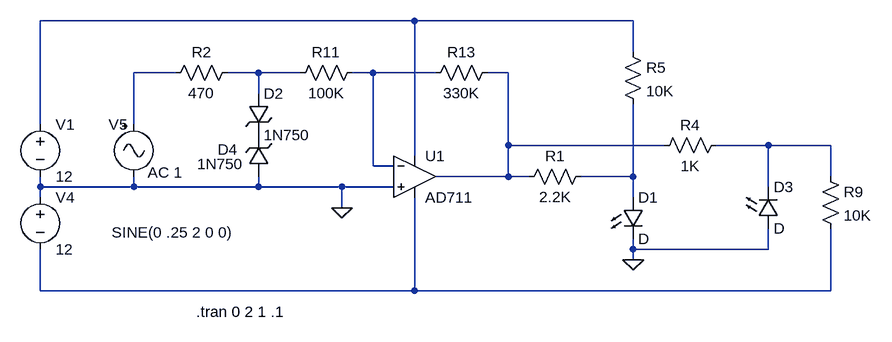
[diagram p0: schematic sigmon2.asc]
sigmon2.asc, the LTspice schematic file:
Version 4
SHEET 1 1412 736
WIRE 336 128 -240 128
WIRE 672 128 336 128
WIRE 672 176 672 128
WIRE -32 208 -96 208
WIRE 96 208 48 208
WIRE 160 208 96 208
WIRE 272 208 240 208
WIRE 368 208 272 208
WIRE 480 208 448 208
WIRE 96 240 96 208
WIRE -240 288 -240 128
WIRE -96 288 -96 208
WIRE 480 320 480 208
WIRE 720 320 480 320
WIRE 880 320 800 320
WIRE 976 320 880 320
WIRE 336 336 336 128
WIRE 272 352 272 208
WIRE 304 352 272 352
WIRE 480 368 480 320
WIRE 480 368 368 368
WIRE 512 368 480 368
WIRE 672 368 672 256
WIRE 672 368 592 368
WIRE 976 368 976 320
WIRE -240 384 -240 368
WIRE -96 384 -96 368
WIRE -96 384 -240 384
WIRE 96 384 96 368
WIRE 96 384 -96 384
WIRE 224 384 96 384
WIRE 304 384 224 384
WIRE 880 384 880 320
WIRE -240 400 -240 384
WIRE 672 400 672 368
WIRE 224 416 224 384
WIRE 672 480 672 464
WIRE 880 480 880 448
WIRE 880 480 672 480
WIRE 672 496 672 480
WIRE -240 544 -240 480
WIRE 336 544 336 400
WIRE 336 544 -240 544
WIRE 976 544 976 448
WIRE 976 544 336 544
FLAG 224 416 0
FLAG 672 496 0
SYMBOL voltage -240 272 R0
WINDOW 123 0 0 Left 0
WINDOW 39 0 0 Left 0
SYMATTR InstName V1
SYMATTR Value 12
SYMBOL voltage -240 384 R0
WINDOW 123 0 0 Left 0
WINDOW 39 0 0 Left 0
SYMATTR InstName V4
SYMATTR Value 12
SYMBOL res 256 192 R90
WINDOW 0 0 56 VBottom 2
WINDOW 3 32 56 VTop 2
SYMATTR InstName R11
SYMATTR Value 100K
SYMBOL res 464 192 R90
WINDOW 0 0 56 VBottom 2
WINDOW 3 32 56 VTop 2
SYMATTR InstName R13
SYMATTR Value 330K
SYMBOL Misc\\signal -96 272 R0
WINDOW 123 21 90 Left 2
WINDOW 39 0 0 Left 0
WINDOW 3 -34 182 Left 2
WINDOW 0 -39 16 Left 2
SYMATTR Value2 AC 1
SYMATTR Value SINE(0 .25 2 0 0)
SYMATTR InstName V5
SYMBOL Opamps\\AD711 336 304 R0
SYMATTR InstName U1
SYMBOL LED 656 400 R0
SYMATTR InstName D1
SYMBOL res 496 384 R270
WINDOW 0 32 56 VTop 2
WINDOW 3 0 56 VBottom 2
SYMATTR InstName R1
SYMATTR Value 2.2K
SYMBOL res 656 160 R0
SYMATTR InstName R5
SYMATTR Value 10K
SYMBOL LED 864 448 M180
WINDOW 0 24 64 Left 2
WINDOW 3 24 0 Left 2
SYMATTR InstName D3
SYMBOL res 704 336 R270
WINDOW 0 32 56 VTop 2
WINDOW 3 0 56 VBottom 2
SYMATTR InstName R4
SYMATTR Value 1K
SYMBOL res 960 352 R0
SYMATTR InstName R9
SYMATTR Value 10K
SYMBOL zener 112 368 R180
WINDOW 0 48 42 Left 2
WINDOW 3 39 19 Left 2
SYMATTR InstName D4
SYMATTR Value 1N750
SYMATTR Description Diode
SYMATTR Type diode
SYMBOL res 64 192 R90
WINDOW 0 0 56 VBottom 2
WINDOW 3 32 56 VTop 2
SYMATTR InstName R2
SYMATTR Value 470
SYMBOL zener 80 240 R0
SYMATTR InstName D2
SYMATTR Value 1N750
SYMATTR Description Diode
SYMATTR Type diode
TEXT 0 576 Left 2 !.tran 0 2 1 .1

The netlist it stands for:
* sigmon2.asc
V1 N001 0 12
V4 0 N008 12
R11 N004 N003 100K
R13 N005 N004 330K
V5 N002 0 SINE(0 .25 2 0 0) AC 1
XU1 0 N004 N001 N008 N005 AD712  ; AD711, pins In+ In- V+ V- OUT
D1 N007 0 D
R1 N005 N007 2.2K
R5 N001 N007 10K
D3 0 N006 D
R4 N005 N006 1K
R9 N006 N008 10K
D4 0 P001 1N750
R2 N003 N002 470
D2 N003 P001 1N750
.model D D
.lib standard.dio
.tran 0 2 1 .1
.lib ADI1.lib
.backanno
.end